# EAGLE design ik_pikit_starter (EAGLE 7.1.0)
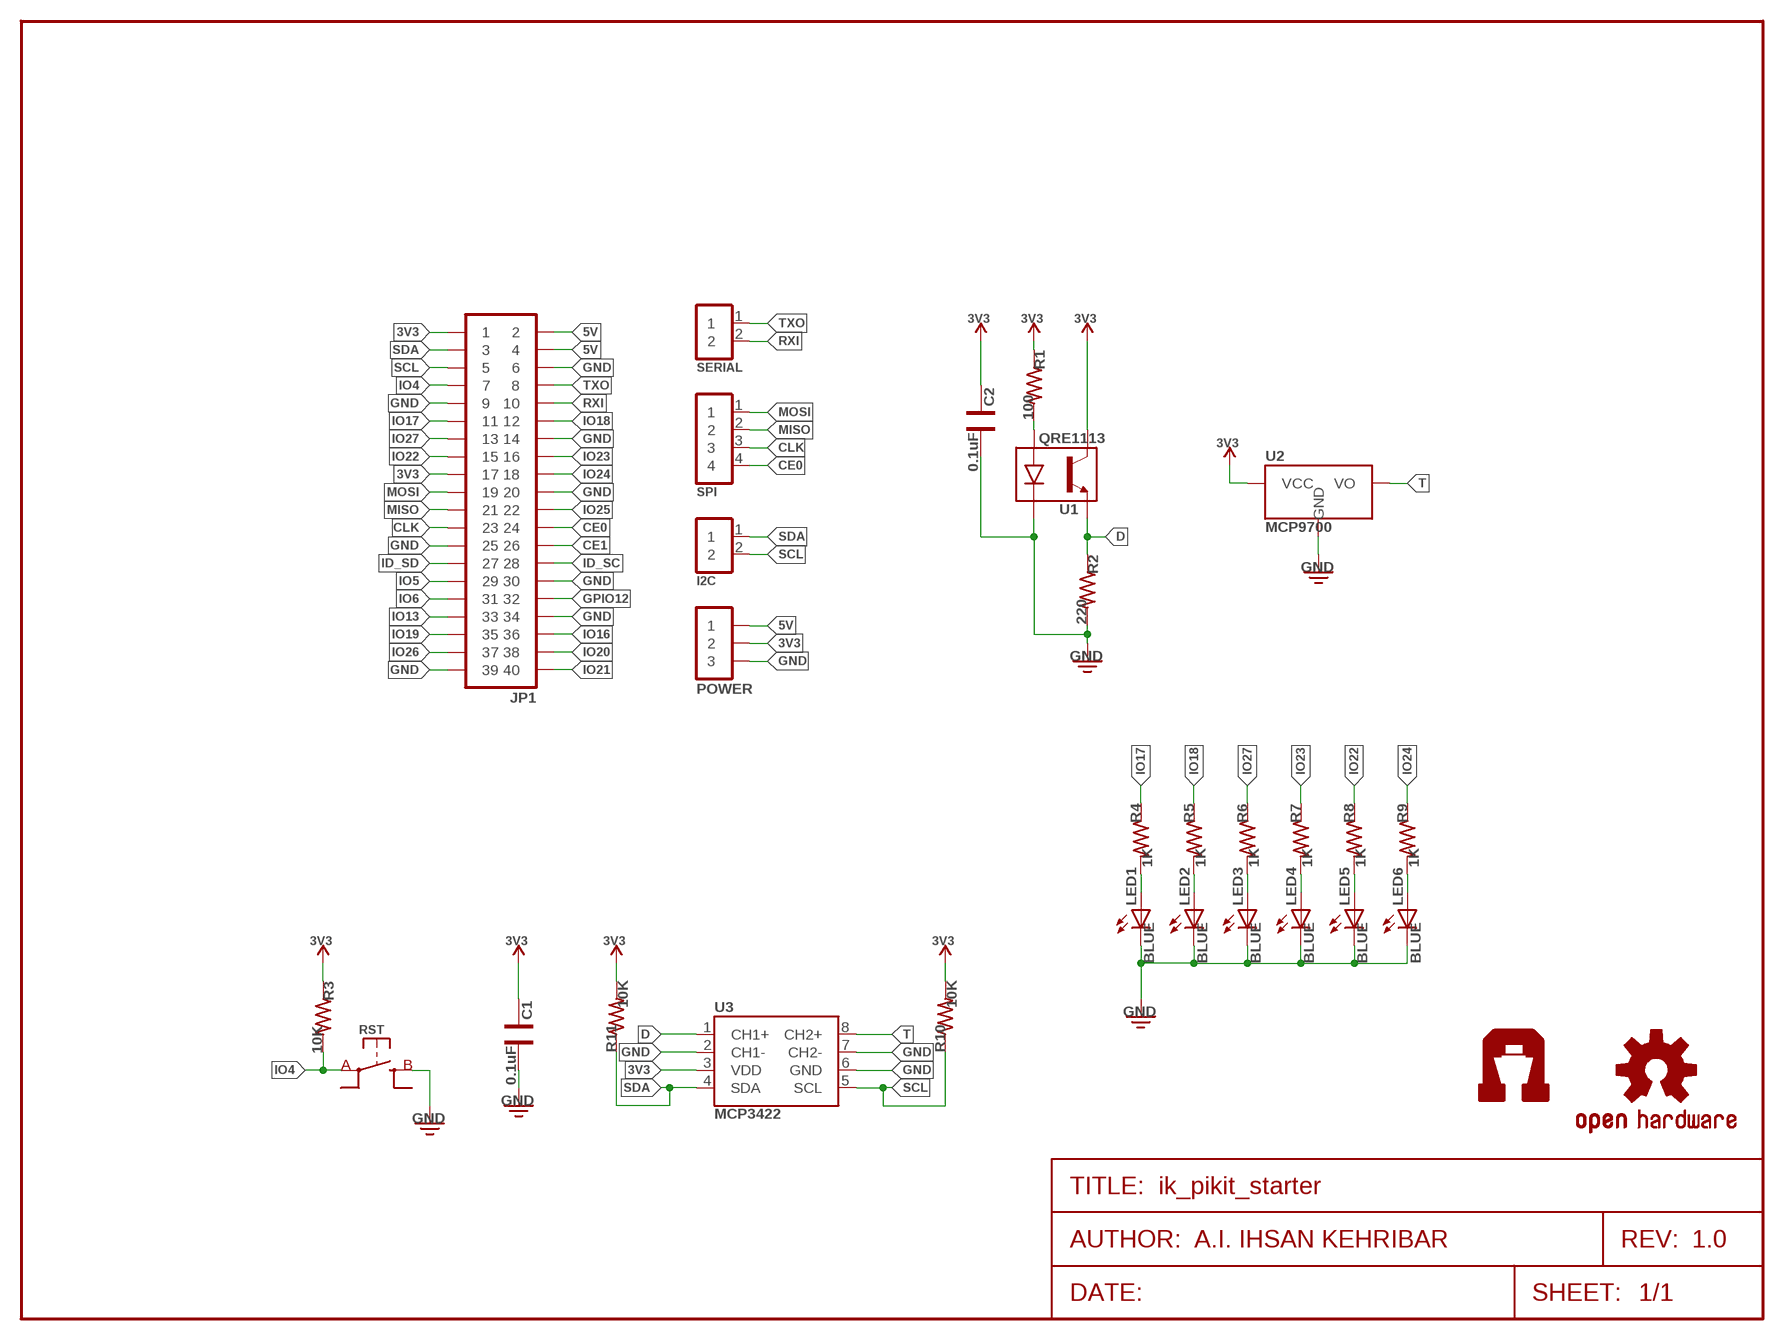
[diagram p0: schematic, sheet 1]
FRAME1 (FRAME-LETTER): AUTHOR: A.I. IHSAN KEHRIBAR; REV: 1.0

## Parts
C1  0.1uF  CAP0805  [CAP-0805]
C2  0.1uF  CAP0805  [CAP-0805]
I2C  1X02NOFIRST  [1X02-NOFIRST]
JP1  2X20  [2X20-RPI-BRK]
LED1  BLUE  LED0805  [LED-0805]
LED2  BLUE  LED0805  [LED-0805]
LED3  BLUE  LED0805  [LED-0805]
LED4  BLUE  LED0805  [LED-0805]
LED5  BLUE  LED0805  [LED-0805]
LED6  BLUE  LED0805  [LED-0805]
LOGO1  OSHW-LOGOS  [OSHW-LOGO-S]
POWER  1X03NOFIRST  [1X03-NOFIRST]
R1  100  RES0805  [RES-0805]
R2  220  RES0805  [RES-0805]
R3  10K  RES0805  [RES-0805]
R4  1K  RES0805  [RES-0805]
R5  1K  RES0805  [RES-0805]
R6  1K  RES0805  [RES-0805]
R7  1K  RES0805  [RES-0805]
R8  1K  RES0805  [RES-0805]
R9  1K  RES0805  [RES-0805]
R10  10K  RES0805  [RES-0805]
R11  10K  RES0805  [RES-0805]
RST  SW-SPSTSMD06X06  [SW-SPST-SMD06X06]
SERIAL  1X02NOFIRST  [1X02-NOFIRST]
SPI  1X04NOFIRST  [1X04-NOFIRST]
U1  QRE1113  [QRE1113]
U2  MCP9700SMD  [SOT23-3]
U3  MCP3422  [SO08]
U$3  AI-LOGOXS  [AI-LOGO-XS]

## Nets
3V3: C1.2 C2.2 JP1.1 JP1.17 POWER.2 R1.1 R3.1 R10.2 R11.2 U1.3(CO) U2.1(VCC) U3.3(VDD)
5V: JP1.2 JP1.4 POWER.1
CE0: JP1.24 SPI.4
CE1: JP1.26
CLK: JP1.23 SPI.3
D: R2.1 U1.4(E) U3.1(CH1+)
GND: C1.1 C2.1 JP1.6 JP1.9 JP1.14 JP1.20 JP1.25 JP1.30 JP1.34 JP1.39 LED1.C LED2.C LED3.C LED4.C LED5.C LED6.C POWER.3 R2.2 RST.B@1(B) RST.B@2(B) U1.2(CA) U2.3(GND) U3.2(CH1-) U3.6(GND) U3.7(CH2-)
GPIO12: JP1.32
ID_SC: JP1.28
ID_SD: JP1.27
IO4: JP1.7 R3.2 RST.A@1(A) RST.A@2(A)
IO5: JP1.29
IO6: JP1.31
IO13: JP1.33
IO16: JP1.36
IO17: JP1.11 R4.1
IO18: JP1.12 R5.1
IO19: JP1.35
IO20: JP1.38
IO21: JP1.40
IO22: JP1.15 R8.1
IO23: JP1.16 R7.1
IO24: JP1.18 R9.1
IO25: JP1.22
IO26: JP1.37
IO27: JP1.13 R6.1
MISO: JP1.21 SPI.2
MOSI: JP1.19 SPI.1
N$1: R1.2 U1.1(A)
N$3: LED5.A R8.2
N$4: LED1.A R4.2
N$5: LED2.A R5.2
N$6: LED3.A R6.2
N$7: LED4.A R7.2
N$8: LED6.A R9.2
RXI: JP1.10 SERIAL.2
SCL: I2C.2 JP1.5 R10.1 U3.5(SCL)
SDA: I2C.1 JP1.3 R11.1 U3.4(SDA)
T: U2.2(VO) U3.8(CH2+)
TXO: JP1.8 SERIAL.1

## Library data of the parts
C1 C2 = Ai_Passives:CAP
I2C SERIAL = Ai_Connectors:1X02
JP1 = Ai_Connectors:2X20
LED1-LED6 = Ai_LED:LED
LOGO1 = Ai_Miscellany:OSHW-LOGO
POWER = Ai_Connectors:1X03
R1-R11 = Ai_Passives:RES: Part # blah Digikey
RST = Ai_Electromechanical:SW-SPST
SPI = Ai_Connectors:1X04
U1 = Ai_IC:QRE1113
U2 = Ai_IC:MCP9700
U3 = Ai_IC:MCP3422
U$3 = Ai_Miscellany:AI-LOGO

## Board
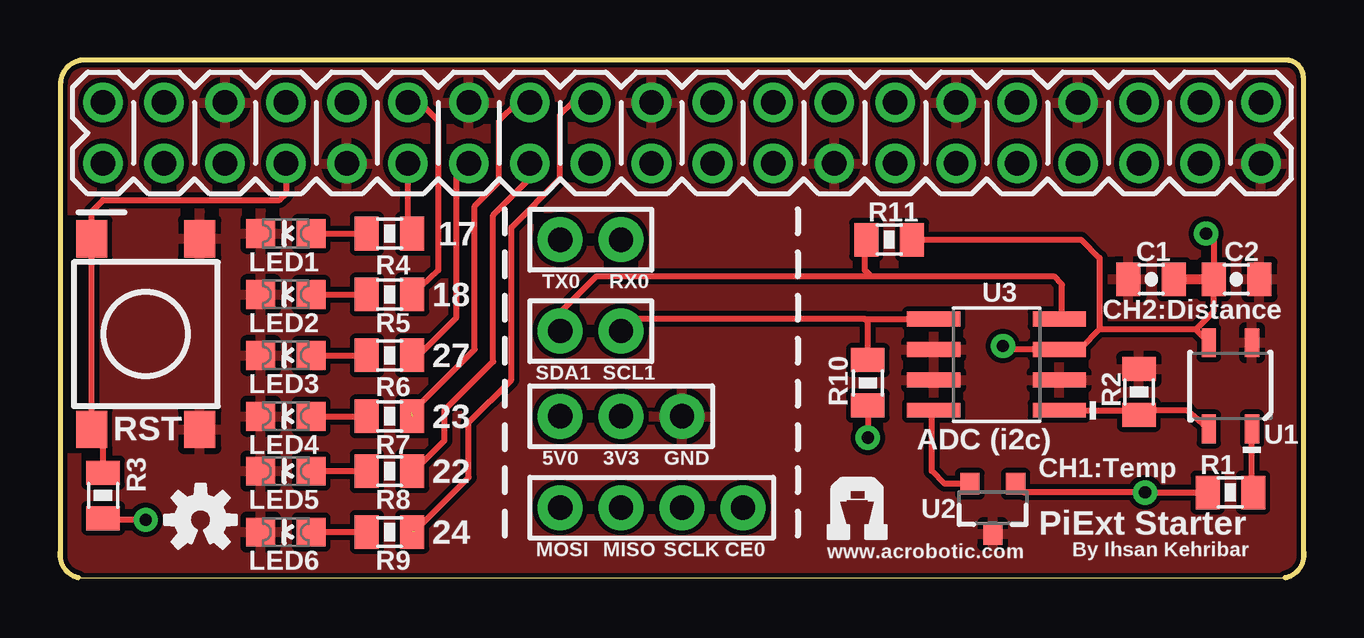
[diagram p1: board, top side]
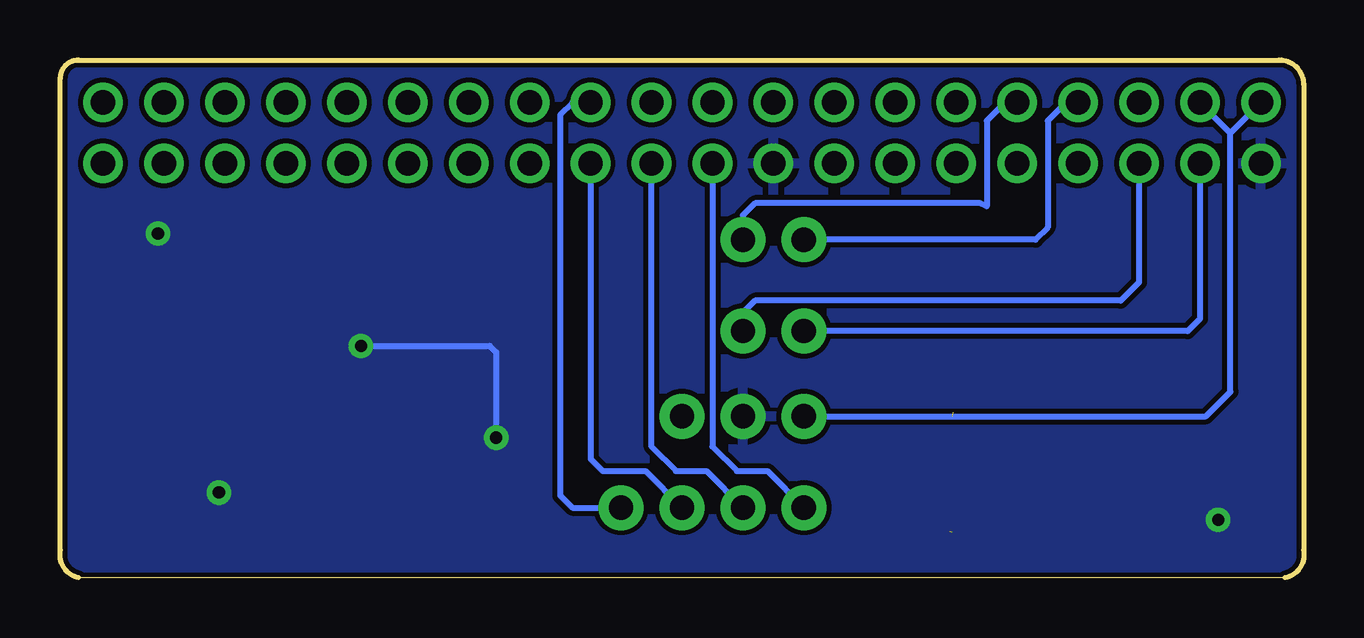
[diagram p2: board, bottom side, seen from below]

Size 51.85 x 21.59 mm. Coordinates in mm from the lower left corner, seen from the top.
Outline: 0.02,20.57 0.02,1.14 arc90 0.78,0 51.07,0 arc90 51.83,1.14 51.83,20.83 arc90 51.07,21.59 1.03,21.59 arc90 0.02,20.57
Copper layers (1*16): Top 0.035mm / dielectric 1.5mm / Bottom 0.035mm
Design rules "ai_2layer": minimum track width 7mil, minimum drill 15mil, track to track 8mil, track to pad 8mil, pad to pad 8mil, via to via 8mil, smd to smd 8mil, copper to edge 8mil, drill to drill 8mil, minimum pad ring 12mil, minimum via ring 10mil, stop-mask expansion 4mil, vias tented up to drill 20mil, thermal gap 10mil

### Footprints (pad centres in the part's own frame; a part is rotated, then mirrored left to right if it is on the bottom)
CAP-0805 = smd 1 x 1.4: 1 -0.95,0; 2 0.95,0
1X02-NOFIRST = drill 1.016 pad 1.88: 1 -1.27,0; 2 1.27,0
2X20-RPI-BRK = drill 1.016 pad 1.651: 1 -24.13,-1.27; 2 -24.13,1.27; 3 -21.59,-1.27; 4 -21.59,1.27; 5 -19.05,-1.27; 6 -19.05,1.27; 7 -16.51,-1.27; 8 -16.51,1.27; 9 -13.97,-1.27; 10 -13.97,1.27; 11 -11.43,-1.27; 12 -11.43,1.27; 13 -8.89,-1.27; 14 -8.89,1.27; 15 -6.35,-1.27; 16 -6.35,1.27; 17 -3.81,-1.27; 18 -3.81,1.27; 19 -1.27,-1.27; 20 -1.27,1.27; 21 1.27,-1.27; 22 1.27,1.27; 23 3.81,-1.27; 24 3.81,1.27; 25 6.35,-1.27; 26 6.35,1.27; 27 8.89,-1.27; 28 8.89,1.27; 29 11.43,-1.27; 30 11.43,1.27; 31 13.97,-1.27; 32 13.97,1.27; 33 16.51,-1.27; 34 16.51,1.27; 35 19.05,-1.27; 36 19.05,1.27; 37 21.59,-1.27; 38 21.59,1.27; 39 24.13,-1.27; 40 24.13,1.27
LED-0805 = smd 1.2 x 1.2: A 0,-1.05; C 0,1.05
1X03-NOFIRST = drill 1.016 pad 1.88: 1 -2.54,0; 2 0,0; 3 2.54,0
RES-0805 = smd 1 x 1.4: 1 -0.95,0; 2 0.95,0
SW-SPST-SMD06X06 = smd 1.55 x 1.3: A@1 -3.975,-2.25; A@2 3.975,-2.25; B@1 -3.975,2.25; B@2 3.975,2.25
1X04-NOFIRST = drill 1.016 pad 1.88: 1 -3.81,0; 2 -1.27,0; 3 1.27,0; 4 3.81,0
QRE1113 = smd 1.2 x 0.6: 1 -1.8,-0.9; 2 1.8,-0.9; 3 1.8,0.9; 4 -1.8,0.9
SOT23-3 = smd 0.8 x 0.9: 1 -0.95,-1; 2 0.95,-1; 3 0,1.1
SO08 = smd 0.61 x 2.21: 1 -1.905,-2.616; 2 -0.635,-2.616; 3 0.635,-2.616; 4 1.905,-2.616; 5 1.905,2.616; 6 0.635,2.616; 7 -0.635,2.616; 8 -1.905,2.616

### Placement (x,y rotation side)
C1  45.48,12.45 0 top
C2  49.04,12.45 180 top
I2C  22.12,10.29 0 top
JP1  25.93,18.54 0 top
LED1  9.42,14.35 90 top
LED2  9.42,11.81 90 top
LED3  9.42,9.27 90 top
LED4  9.42,6.73 90 top
LED5  9.42,4.45 90 top
LED6  9.42,1.91 90 top
LOGO1  5.86,2.41 0 top
POWER  23.39,6.73 0 top
R1  48.79,3.56 0 top
R2  44.98,7.75 90 top
R3  1.8,3.43 90 top
R4  13.73,14.35 180 top
R5  13.73,11.81 180 top
R6  13.73,9.27 180 top
R7  13.73,6.73 180 top
R8  13.73,4.45 180 top
R9  13.73,1.91 180 top
R10  33.67,8.13 270 top
R11  34.56,14.1 0 top
RST  3.57,10.16 270 top
SERIAL  22.12,14.1 0 top
SPI  24.66,2.92 0 top
U1  48.79,8 90 top
U2  38.88,2.92 180 top
U3  39.03,8.88 90 top
U$3  31.9,1.52 0 top

### Tracks (layer width: path | path; a pad name or v marks a point on that pad's centre or on a via)
3V3  (via drill 0.51)
  Top 0.254: 47.77,9.8 U1.3 47.34,10.35 | 43.33,10.35 42.56,9.59 41.72,9.59 U3.3 39.45,9.52 v39.31,9.66 | v3.57,2.41 1.86,2.41 R3.1 | 39.85,3.94 U2.1 40.2,3.56 v45.23,3.56 R1.1 | R10.2 v33.67,5.84 | R11.2 42.56,14.1 43.33,13.34 43.33,10.35 | 47.34,10.35 43.33,10.35 | 47.34,10.35 48.09,11.1 C2.2 48.09,14.03 v47.77,14.35
  Top 0.406: C1.2 C2.2
  Bottom 0.254: v39.31,9.66 33.94,9.66 33.67,9.4 v33.67,5.84
  pour Bottom: 0.02,21.59 51.83,21.59 51.83,0 0.02,0
5V
  Bottom 0.254: POWER.1 4.08,6.73 3.07,7.75 3.07,18.54 | 3.07,18.54 JP1.2 | JP1.4 3.07,18.54
CE0
  Bottom 0.254: JP1.24 30.5,19.81 31.01,19.3 31.01,3.43 30.5,2.92 SPI.4
CLK
  Bottom 0.254: JP1.23 29.74,4.95 29.23,4.45 27.45,4.45 SPI.3
D
  Top 0.254: U1.4 46.99,6.98 44.98,6.98 | U3.1 44.98,6.98 | 44.98,6.98 R2.1
GND
  pour Top: 0.02,21.59 51.83,21.59 51.83,0 0.02,0
IO4
  Top 0.254: JP1.7 9.42,16 9.16,15.75 1.8,15.75 1.32,15.28 RST.A@1 RST.A@2 1.8,5.71 R3.2
IO17
  Top 0.254: JP1.11 14.5,14.54 R4.1
IO18
  Top 0.254: JP1.12 15,19.81 15.77,19.05 15.77,12.83 R5.1
IO22
  Top 0.254: JP1.15 19.58,16.64 18.05,15.11 18.05,9.02 16.02,6.99 16.02,5.71 14.75,4.45 R8.1
IO23  (1 unrouted)
  Top 0.254: JP1.16 19.07,19.81 18.31,19.05 18.31,16.51 17.29,15.49 17.29,9.53 14.66,6.89 14.63,6.89
IO24  (1 unrouted)
  Top 0.254: JP1.18 21.35,19.81 20.85,19.3 20.85,16.64 18.81,14.61 18.81,8.26 17.04,6.48 17.04,4.19 14.78,1.94 14.75,1.94
IO27
  Top 0.254: JP1.13 16.53,16.67 16.53,10.86 14.94,9.27 R6.1
MISO
  Bottom 0.254: JP1.21 27.2,5.46 26.18,4.45 24.91,4.45 SPI.2
MOSI
  Bottom 0.254: JP1.19 24.66,5.46 23.64,4.45 22.37,4.45 SPI.1
N$1
  Top 0.254: R1.2 49.66,4.05 49.69,4.05 U1.1
N$3
  Top 0.254: LED5.A R8.2
N$4
  Top 0.254: LED1.A R4.2
N$5
  Top 0.254: LED2.A R5.2
N$6
  Top 0.254: LED3.A R6.2
N$7
  Top 0.254: LED4.A R7.2
N$8
  Top 0.254: LED6.A R9.2
RXI
  Bottom 0.254: JP1.10 12.46,19.81 13.23,19.05 13.23,15.49 13.48,15.62 22.88,15.62 23.39,15.11 SERIAL.2
SCL
  Top 0.254: 33.55,10.79 23.89,10.79 I2C.2 | R10.1 33.67,10.67 33.55,10.79 | 33.55,10.79 U3.5
  Bottom 0.254: JP1.5 6.88,12.32 7.64,11.56 22.88,11.56 23.39,11.05 I2C.2
SDA
  Top 0.254: I2C.1 20.85,11.05 22.37,12.57 33.8,12.57 | 33.8,12.57 41.42,12.57 41.77,12.22 41.77,10.91 U3.4 | 33.8,12.57 33.55,12.83 33.55,14.03 R11.1
  Bottom 0.254: JP1.3 4.34,10.79 4.84,10.29 I2C.1
T
  Top 0.254: U2.2 36.86,3.92 36.34,4.45 36.34,6.9 U3.8
TXO
  Bottom 0.254: JP1.8 9.92,19.81 10.69,19.05 10.69,14.61 11.19,14.1 SERIAL.1

### Text on the board
tPlace: 17 | TX0 | RX0 | 18 | CH2:Distance | 27 | SDA1 | SCL1 | 23 | 5V0 | 3V3 | GND | ADC (i2c) | 22 | CH1:Temp | PiExt Starter | 24 | MOSI | MISO | SCLK | CE0 | www.acrobotic.com | By Ihsan Kehribar